# Altium schematic sheet Sheet2.SchDoc
size A; SheetNumber: 2; SheetTotal: 2
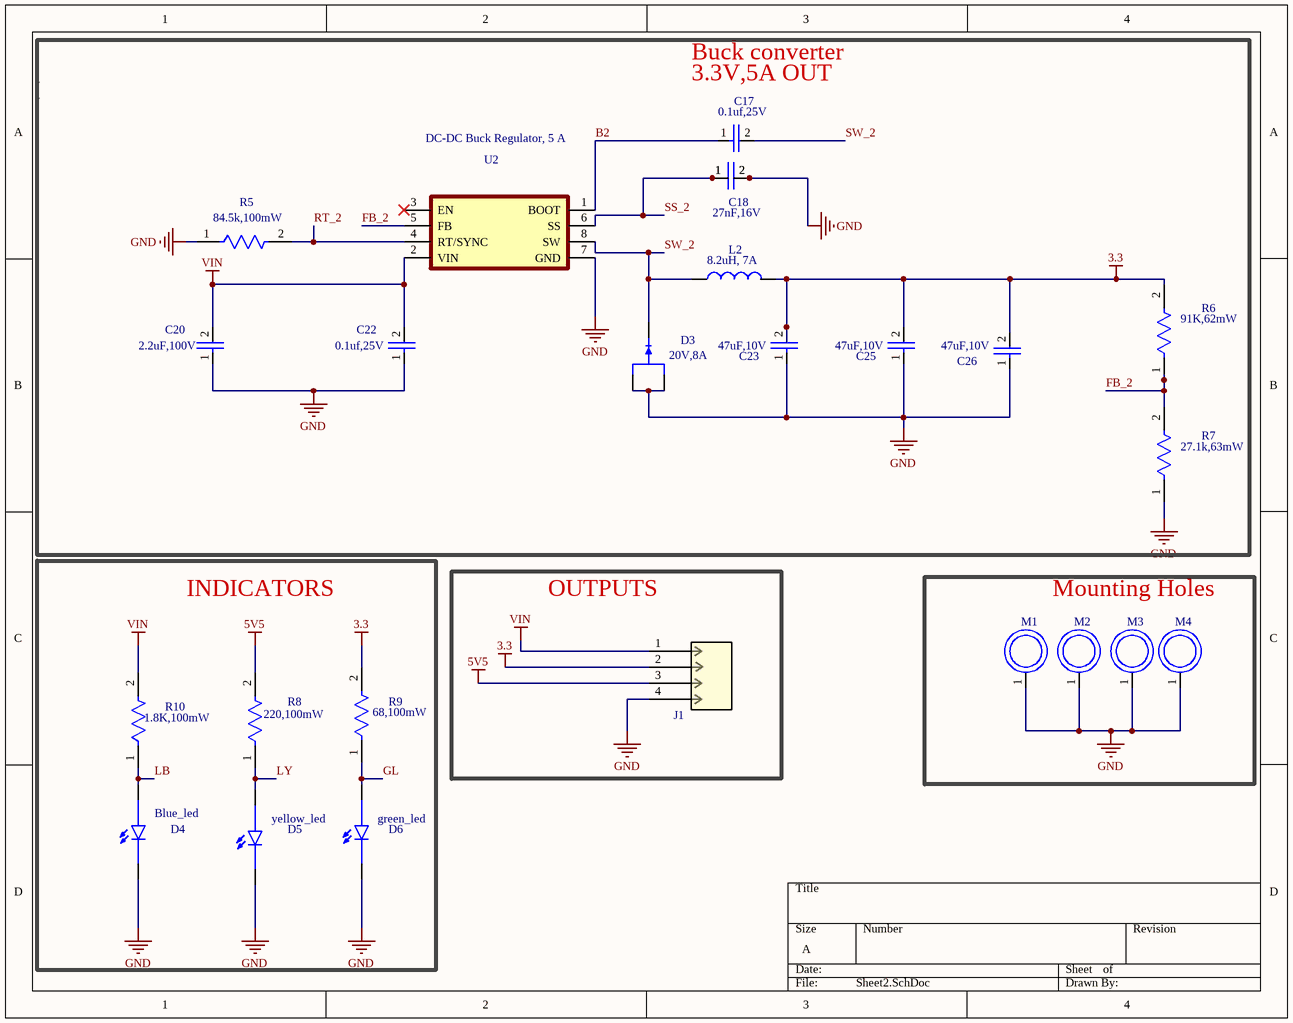
[diagram p0: Sheet2.SchDoc]

## Parts
C17  0.1uf,25V  [CC0603KRX7R8BB104]
C18  27nF,16V  [C0805C273K4HACAUTO]
C20  2.2uF,100V  [CL31A106KBHNNNE]
C22  0.1uf,25V  [CC0603KRX7R8BB104]
C23  47uF,10V  [GRM31CR61A476ME15L]
C25  47uF,10V  [GRM31CR61A476ME15L]
C26  47uF,10V  [GRM31CR61A476ME15L]
D3  20V,8A  [SS12P2L-M3/86A]
D4  Blue_led  [XL-1608UBC-04]
D5  yellow_led  [XL-1608UWC-04]
D6  green_led  [LTST-C190GKT]
J1  Through Hole,P=2.54mm  [PBC04SAAN]  (value not drawn)
L2  8.2uH, 7A  [SCIHP1040-8R2M]
M1  2..2mm  [mountinh hole]  (value not drawn)
M2  2..2mm  [mountinh hole]  (value not drawn)
M3  2..2mm  [mountinh hole]  (value not drawn)
M4  2..2mm  [mountinh hole]  (value not drawn)
R5  84.5k,100mW  [RC0603FR-0784K5L]
R6  91K,62mW  [RC0402FR-0791KL]
R7  27.1k,63mW  [TNPW040227K1BEED]
R8  220,100mW  [RMCF0603JT220R]
R9  68,100mW  [RC0603JR-0768RL]
R10  1.8K,100mW  [RMCF0603JT1K80]
U2  DC-DC Buck Regulator, 5 A  [LMR14050SDDAR]

## Blocks framed on the sheet
INDICATORS: D4-D6 R8-R10
OUTPUTS: J1
Mounting Holes: M1-M4

## Nets
3.3: C23.2 C25.2 C26.2 J1.2 L2.2 R6.2 R9.2
5V5: J1.3 R8.2
GND: C18.2 C20.1 C22.1 C23.1 C25.1 C26.1 D3.1(A1) D3.2(A2) D4.C D5.C D6.C J1.4 M1.1 M2.1 M3.1 M4.1 R5.1 R7.1 U2.7(GND)
VIN: C20.2 C22.2 J1.1 R10.2 U2.2(VIN)
B2: C17.1 U2.1(BOOT)
FB_2: R6.1 R7.2 U2.5(FB)
GL: D6.A R9.1
LB: D4.A R10.1
LY: D5.A R8.1
RT_2: R5.2 U2.4(RT/SYNC)
SS_2: C18.1 U2.6(SS)
SW_2: C17.2 D3.3(K) L2.1 U2.8(SW)

Not connected (* = marked no-connect by the designer): U2 3(EN)*

## Notes on the sheet
- Buck converter
- (near C17) 3.3V,5A OUT

## Library data of the parts
C17 C22 = CC0603KRX7R8BB104: 25V 100nF X7R ±10% 0603 Ceramic Capacitors ROHS; manafucturer part number: CC0603KRX7R8BB104; supplier part number: C92490
C18 = C0805C273K4HACAUTO: 16V 27nF X8R ±10% 0805 Ceramic Capacitors ROHS; manafucturer part search: C0805C273K4HACAUTO; supplier part number: C2218666
C20 = CL31B225KCHSNNE: 100V 2.2uF X7R ±10% 1206 Ceramic Capacitors ROHS; manafucturer part number: CL31B225KCHSNNE; supplier part number: C170101
C23 C25 C26 = GRM31CR61A476ME15L: 10V 47uF X5R ±20% 1206 Ceramic Capacitors ROHS; manafucturer part number: GRM31CR61A476ME15L; supplier part number: C94034
D3 = SS12P2L-M3/86A: 20V 560mV@12A 12A TO-277A Single Diodes ROHS; manafucturer part number: SS12P2L-M3/86A; supplier part number: C3758037
D4 = XL-1608UBC-04: 20mA 3.3V Blue 70mW 0603 LED Indication - Discrete ROHS; manafucturer part number: XL-1608UBC-04; supplier part number: C965807
D5 = XL-1608UWC-04: 20mA 13700K~33000K White 2.7V 70mW 0603 LED Indication - Discrete ROHS; manafucturer part search: XL-1608UWC-04; supplier part search: C965808
D6 = LTST-C190GKT: 63mW 27.1kΩ ±25ppm/℃ Thin Film Resistor ±0.1% 0402 Chip Resistor - Surface Mount ROHS; manafucturer part search: TNPW040227K1BEED; supplier part number: C4266737
J1 = PBC04SAAN: Black 4P Tin 2.54mm Phosphor Bronze 3A 1 Through Hole -65℃~+125℃ Through Hole,P=2.54mm Headers, Male Pins ROHS; manafucturer part search: PBC04SAAN; supplier part number: C5707257
L2 = SCIHP1040-8R2M: 7A 8.2uH ±20% 10A 31mΩ SMD,11.5x10.2mm Fixed Inductors ROHS; manafucturer part number: SCIHP1040-8R2M; supplier part number: C6293289
M1-M4 = mountin_holes: mounting hole 2.2m
R5 = RC0603FR-0784K5L: 100mW 84.5kΩ 75V ±100ppm/℃ Thick Film Resistor ±1% 0603 Chip Resistor - Surface Mount ROHS; manafucturer part number: RC0603FR-0784K5L; supplier part number: C326920
R6 = RC0402FR-0791KL: 91kΩ 62.5mW 50V ±100ppm/℃ Thick Film Resistor ±1% 0402 Chip Resistor - Surface Mount ROHS; manafucturer part search: RC0402FR-0791KL; supplier part number: C327323
R7 = TNPW040227K1BEED: 63mW 27.1kΩ ±25ppm/℃ Thin Film Resistor ±0.1% 0402 Chip Resistor - Surface Mount ROHS; manafucturer number: TNPW040227K1BEED; supplier number: C4266737
R8 = RMCF0603JT220R: 100mW 220Ω 75V ±200ppm/℃ Thick Film Resistor ±5% 0603 Chip Resistor - Surface Mount ROHS; manafucturer part search: RMCF0603JT220R; supplier part search: C2484076
R9 = RC0603JR-0768RL: 100mW 68Ω 75V ±100ppm/℃ Thick Film Resistor ±5% 0603 Chip Resistor - Surface Mount ROHS; manafucturer part search: RC0603JR-0768RL; supplier part search: C163413
R10 = RMCF0603JT1K80: 100mW 1.8kΩ 75V ±200ppm/℃ Thick Film Resistor ±5% 0603 Chip Resistor - Surface Mount ROHS; manafucturer part search: RMCF0603JT1K80; supplier part search: C2483889
U2 = LMR14050SDDAR: 2.5MHz 5A Buck Adjustable 800mV~28V 1 SOIC-8-EP Voltage Regulators - DC DC Switching Regulators ROHS; manafucturer part number: LMR14050SDDAR; supplier part number: C155484